# Altium schematic sheet Schematic diagram of wheel speed and distance measurement alarm design.schdoc
size 308 x 222 mm
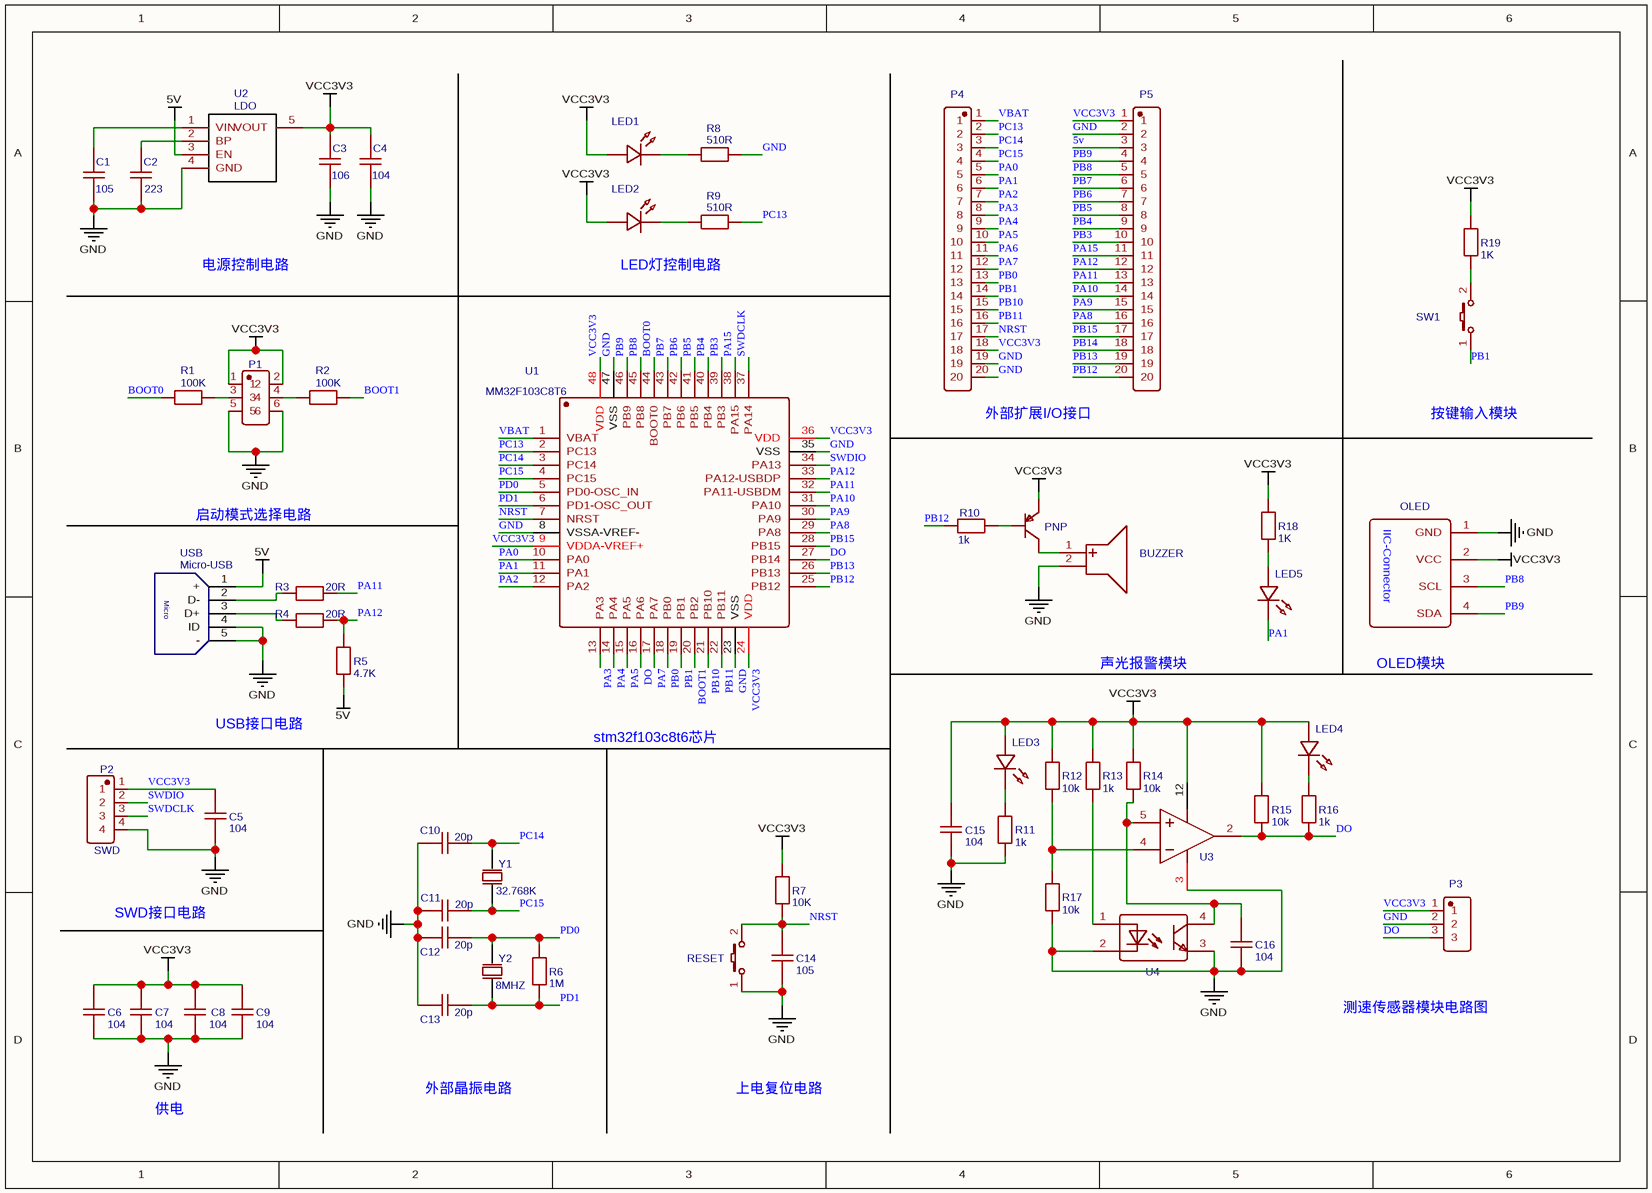
[diagram p0: Schematic diagram of wheel speed and distance measurement alarm design.schdoc]

## Parts
BUZZER  GMC1205YA-16R2048  [BUZ-TH_BD12.0-P6.50-D0.6-FD]  (value not drawn)
C1  105  [C0603]
C2  223  [C0603]
C3  106  [C0603]
C4  104  [C0603]
C5  104  [C0603]
C6  104  [C0603]
C7  104  [C0603]
C8  104  [C0603]
C9  104  [C0603]
C10  20p  [C0603]
C11  20p  [C0603]
C12  20p  [C0603]
C13  20p  [C0603]
C14  105  [C0603]
C15  104  [C0603]
C16  104  [C0603]
LED1  LED-0603_R  [LED0603_RED]  (value not drawn)
LED2  LED-0603_R  [LED0603_RED]  (value not drawn)
LED3  LED-0603_R  [LED0603_RED]  (value not drawn)
LED4  LED-0603_R  [LED0603_RED]  (value not drawn)
LED5  LED-0603_R  [LED0603_RED]  (value not drawn)
OLED  0.96OLED_4P_MODULE_JX  [0.96OLED_4P]  (value not drawn)
P1  双排针蓝A_HEADER3X2  [HDR-TH_6P-P2.54-V-M-R2-C3-S2.54-1]  (value not drawn)
P2  SWD  [HDR-TH_4P-P2.54-V-M-1]
P3  CON3-2.54_C9900003715  [HDR-TH_3P-P2.54-V-M-1]  (value not drawn)
P4  GPHA101-2002A001A1BA  [HDR-TH_20P-P2.54-V-M]  (value not drawn)
P5  GPHA101-2002A001A1BA  [HDR-TH_20P-P2.54-V-M]  (value not drawn)
PNP  2SA1182-Y,LF  [SOT-23-3_L2.9-W1.3-P1.90-LS2.6-BR]  (value not drawn)
R1  100K  [R0603]
R2  100K  [R0603]
R3  20R  [R0603]
R4  20R  [R0603]
R5  4.7K  [R0603]
R6  1M  [R0603]
R7  10K  [R0603]
R8  510R  [R0603]
R9  510R  [R0603]
R10  1k  [R0603]
R11  1k  [R0603]
R12  10k  [R0603]
R13  1k  [R0603]
R14  10k  [R0603]
R15  10k  [R0603]
R16  1k  [R0603]
R17  10k  [R0603]
R18  1K  [R0603]
R19  1K  [R0603]
RESET  K2-3.6×6.1_SMD  [KEY-SMD_2P-L6.2-W3.6-LS8.0]  (value not drawn)
SW1  K2-3.6×6.1_SMD  [KEY-SMD_2P-L6.2-W3.6-LS8.0]  (value not drawn)
U1  MM32F103C8T6  [LQFP-48_L7.0-W7.0-P0.50-LS9.0-BL]
U2  LDO  [LDO23S]
U3  LM2901M  [SOIC-14_L8.7-W3.9-P1.27-LS6.0-BL]  (value not drawn)
U4  LTV-817S-TA1-B  [OPTO-SMD-4_L4.6-W6.5-P2.54-LS10.3-BL]  (value not drawn)
USB  Micro-USB  [MICRO-USB-1]
Y1  32.768K  [OSC-TH_L10.0-W4.5-P5.00]
Y2  8MHZ  [OSC-TH_L10.0-W4.5-P5.00]

## Nets
5v: P5.3 R5.2 U2.3(EN) USB.1(+)
GND: BUZZER.2(-) C1.1 C2.1 C3.1 C4.1 C5.2 C6.2 C7.2 C8.2 C9.2 C10.1 C11.1 C12.1 C13.1 C14.2 C15.2 C16.2 OLED.1(GND) P1.5 P1.6 P2.4 P3.2 P4.19 P4.20 P5.2 R8.2 R11.2 R17.2 RESET.1 U1.8(VSSA-VREF-) U1.23(VSS) U1.35(VSS) U1.47(VSS) U2.4(GND) U3.3(V+) U4.2 U4.3 USB.4(ID) USB.5(-)
VCC3V3: C3.2 C4.2 C5.1 C6.1 C7.1 C8.1 C9.1 C15.1 LED1.1 LED2.1 LED3.1 LED4.1 OLED.2(VCC) P1.1 P1.2 P2.1 P3.1 P4.18 P5.1 PNP.2(E) R7.2 R12.1 R13.1 R14.1 R15.1 R18.1 R19.1 U1.9(VDDA-VREF+) U1.24(VDD) U1.36(VDD) U1.48(VDD) U2.5(VOUT) U3.12(GND)
BOOT0: R1.1 U1.44(BOOT0)
BOOT1: R2.2 U1.20(PB2)
DO: P3.3 R15.2 R16.2 U1.16(PA6) U1.27(PB14) U3.2(OUTPUT1)
NRST: C14.1 P4.17 R7.1 RESET.2 U1.7(NRST)
PA0: P4.5 U1.10(PA0)
PA1: LED5.2 P4.6 U1.11(PA1)
PA2: P4.7 U1.12(PA2)
PA3: P4.8 U1.13(PA3)
PA4: P4.9 U1.14(PA4)
PA5: P4.10 U1.15(PA5)
PA6: P4.11
PA7: P4.12 U1.17(PA7)
PA8: P5.16 U1.29(PA8)
PA9: P5.15 U1.30(PA9)
PA10: P5.14 U1.31(PA10)
PA11: P5.13 R3.2 U1.32(PA11-USBDM)
PA12: P5.12 R4.2 R5.1 U1.33(PA12-USBDP)
PA15: P5.11 U1.38(PA15)
PB0: P4.13 U1.18(PB0)
PB1: P4.14 SW1.1 U1.19(PB1)
PB3: P5.10 U1.39(PB3)
PB4: P5.9 U1.40(PB4)
PB5: P5.8 U1.41(PB5)
PB6: P5.7 U1.42(PB6)
PB7: P5.6 U1.43(PB7)
PB8: OLED.3(SCL) P5.5 U1.45(PB8)
PB9: OLED.4(SDA) P5.4 U1.46(PB9)
PB10: P4.15 U1.21(PB10)
PB11: P4.16 U1.22(PB11)
PB12: P5.20 R10.2 U1.25(PB12)
PB13: P5.19 U1.26(PB13)
PB14: P5.18
PB15: P5.17 U1.28(PB15)
PC13: P4.2 R9.2 U1.2(PC13)
PC14: C10.2 P4.3 U1.3(PC14) Y1.2(OSC2)
PC15: C11.2 P4.4 U1.4(PC15) Y1.1(OSC1)
PD0: C12.2 R6.2 U1.5(PD0-OSC_IN) Y2.2(OSC2)
PD1: C13.2 R6.1 U1.6(PD1-OSC_OUT) Y2.1(OSC1)
SWDCLK: P2.3 U1.37(PA14)
SWDIO: P2.2 U1.34(PA13)
VBAT: P4.1 U1.1(VBAT)
NetBUZZER_1: BUZZER.1(+) PNP.3(C)
NetC1_2: C1.2 U2.1(VIN)
NetC2_2: C2.2 U2.2(BP)
NetC16_1: C16.1 R14.2 U3.5(INPUT1+) U4.4
NetLED1_2: LED1.2 R8.1
NetLED2_2: LED2.2 R9.1
NetLED3_2: LED3.2 R11.1
NetLED4_2: LED4.2 R16.1
NetLED5_1: LED5.1 R18.2
NetP1_3: P1.3 R1.2
NetP1_4: P1.4 R2.1
NetPNP_1: PNP.1(B) R10.1
NetR3_1: R3.1 USB.2(D-)
NetR4_1: R4.1 USB.3(D+)
NetR12_2: R12.2 R17.1 U3.4(INPUT1-)
NetR13_2: R13.2 U4.1
NetR19_2: R19.2 SW1.2

## Notes on the sheet
- 电源控制电路
- LED灯控制电路
- (near P4) 外部扩展I/O接口
- 按键输入模块
- 启动模式选择电路
- 声光报警模块
- (near OLED) OLED模块
- USB接口电路
- stm32f103c8t6芯片
- SWD接口电路
- 测速传感器模块电路图
- 供电
- 外部晶振电路
- 上电复位电路
- (in symbol 0.96OLED_4P_MODULE_JX) IIC-Connector
- (in symbol Micro-USB) Micro

## Library data of the parts
BUZZER = GMC1205YA-16R2048: Manufacturer: INGHAi(赢海); Contributor: LCSC; Frequency: 2048Hz; Supplier: LCSC; Supplier Part: C252915; Manufacturer Part: GMC1205YA-16R2048; JLCPCB Part Class: Extended Part; spicePre: B; spiceSymbolName: GMC1205YA-16R2048
C1 C14 = 105: nameAlias: Value(F); Contributor: LCEDA_Lib; spicePre: C; spiceSymbolName: C_0603_US
C2 = 223: nameAlias: Value(F); Contributor: LCEDA_Lib; spicePre: C; spiceSymbolName: C_0603_US
C3 = 106: nameAlias: Value(F); Contributor: LCEDA_Lib; spicePre: C; spiceSymbolName: C_0603_US
C4-C9 C15 C16 = 104: nameAlias: Value(F); Contributor: LCEDA_Lib; spicePre: C; spiceSymbolName: C_0603_US
C10-C13 = 20p: nameAlias: Value(F); Contributor: LCEDA_Lib; spicePre: C; spiceSymbolName: C_0603_US
LED1-LED5 = LED-0603_R: Manufacturer: EVERLIGHT(台湾亿光); Manufacturer Part: 19-217/R6C-AL1M2VY/3T; Contributor: LCEDA_01; Supplier Part: C72044; Supplier: LCSC; spicePre: L; spiceSymbolName: LED-0603_R
OLED = 0.96OLED_4P_MODULE_JX: Manufacturer: null; Contributor: LCSC; Supplier: LCSC; Supplier Part: C9900004566; Manufacturer Part: 0.96OLED_4P_MODULE_JX; JLCPCB Part Class: Extended Part; spicePre: O; spiceSymbolName: 0.96OLED_4P_MODULE_JX
P1 = 双排针蓝A_HEADER3X2: Manufacturer: null; Contributor: lcsc; Supplier: LCSC; Supplier Part: C9900019268; Manufacturer Part: 双排针蓝A_HEADER3X2; JLCPCB Part Class: Extended Part; spicePre: U; spiceSymbolName: 双排针蓝A_HEADER3X2
P2 = SWD: Manufacturer: HanElectricity(瀚源); Manufacturer Part: 2541WV-04P; Contributor: lcsc; Supplier: LCSC; Supplier Part: C5383113; link: https://atta.szlcsc.com/upload/public/pdf/source/20230330/2BC52F76E32B2D45ECCE68ADA82449DD.pdf; spicePre: U; spiceSymbolName: 2541WV-04P
P3 = CON3-2.54_C9900003715: Manufacturer: null; Contributor: LCSC; Supplier: LCSC; Supplier Part: C9900003715; Manufacturer Part: CON3-2.54; JLCPCB Part Class: Extended Part; spicePre: U; spiceSymbolName: CON3-2.54_C9900003715
P4 P5 = GPHA101-2002A001A1BA: Manufacturer: GREENCONN(格康); Contributor: lcsc; Supplier: LCSC; Supplier Part: C7434502; Manufacturer Part: GPHA101-2002A001A1BA; spicePre: U; spiceSymbolName: GPHA101-2002A001A1BA
PNP = 2SA1182-Y,LF: Manufacturer: TOSHIBA(东芝); Contributor: lcsc; Supplier: LCSC; Supplier Part: C6667875; Manufacturer Part: 2SA1182-Y,LF; spicePre: U; spiceSymbolName: 2SA1182-Y,LF
R1 R2 = 100K: nameAlias: Value(Ω); Contributor: LCEDA_Lib; spicePre: R; spiceSymbolName: R_0603_EU
R3 R4 = 20R: nameAlias: Value(Ω); Contributor: LCEDA_Lib; spicePre: R; spiceSymbolName: R_0603_EU
R5 = 4.7K: nameAlias: Value(Ω); Contributor: LCEDA_Lib; spicePre: R; spiceSymbolName: R_0603_EU
R6 = 1M: nameAlias: Value(Ω); Contributor: LCEDA_Lib; spicePre: R; spiceSymbolName: R_0603_EU
R7 = 10K: nameAlias: Value(Ω); Contributor: LCEDA_Lib; spicePre: R; spiceSymbolName: R_0603_EU
R8 R9 = 510R: nameAlias: Value(Ω); Contributor: LCEDA_Lib; spicePre: R; spiceSymbolName: R_0603_EU
R10 = 1k: Manufacturer: YAGEO(国巨); Manufacturer Part: AC0603DR-07100RL; nameAlias: Resistance (Ohms); Contributor: LCSC; Resistance: 100Ω; Supplier: LCSC; Supplier Part: C227435; JLCPCB Part Class: Extended Part; spicePre: R; spiceSymbolName: AC0603DR-07100RL
R11 R13 R16 = 1k: nameAlias: Value(Ω); Contributor: LCEDA_Lib; spicePre: R; spiceSymbolName: R_0603_EU
R12 R14 R15 R17 = 10k: nameAlias: Value(Ω); Contributor: LCEDA_Lib; spicePre: R; spiceSymbolName: R_0603_EU
R18 R19 = 1K: nameAlias: Value(Ω); Contributor: LCEDA_Lib; spicePre: R; spiceSymbolName: R_0603_EU
RESET SW1 = K2-3.6×6.1_SMD: Manufacturer Part: K2-1107ST-A4SW-06; Contributor: LCEDA_Lib; 制造商: 韩国韩荣; Supplier Part: C118141; Supplier: LCSC; spicePre: K; spiceSymbolName: K2-3.6×6.1_SMD
U1 = MM32F103C8T6: Manufacturer: MindMotion(灵动微); Contributor: LCSC; Supplier: LCSC; Supplier Part: C212243; Manufacturer Part: MM32F103C8T6; JLCPCB Part Class: Extended Part; spicePre: U; spiceSymbolName: MM32F103C8T6
U2 = LDO: Contributor: SuperZc; spicePre: U; spiceSymbolName: LDO
U3 = LM2901M: subpart_no: 1; Manufacturer: TI(德州仪器); Supplier: LCSC; Supplier Part: C2863696; Manufacturer Part: LM2901M; spicePre: U; spiceSymbolName: LM2901M
U4 = LTV-817S-TA1-B: Manufacturer: LITEON(光宝); Supplier: LCSC; Manufacturer Part: LTV-817S-TA1-B; Supplier Part: C109226; JLCPCB Part Class: Extended Part; spicePre: U; spiceSymbolName: LTV-817S-TA1-B
USB = Micro-USB: Manufacturer: SHOU HAN(首韩); Manufacturer Part: MicroXNJ; Contributor: Tsinghua_Lee; Supplier: LCSC; Supplier Part: C404969; spicePre: U; spiceSymbolName: Micro-USB1
Y1 = 32.768K: Manufacturer: YXC; Manufacturer Part: X49UD110592MSD2SC; nameAlias: Value; Supplier: LCSC; Supplier Part: C2194; spicePre: X; spiceSymbolName: X49UD110592MSD2SC
Y2 = 8MHZ: Manufacturer: YXC; Manufacturer Part: X49UD110592MSD2SC; nameAlias: Value; Supplier: LCSC; Supplier Part: C2194; spicePre: X; spiceSymbolName: X49UD110592MSD2SC